# EAGLE design theremin_PCB (EAGLE 7.1.0)
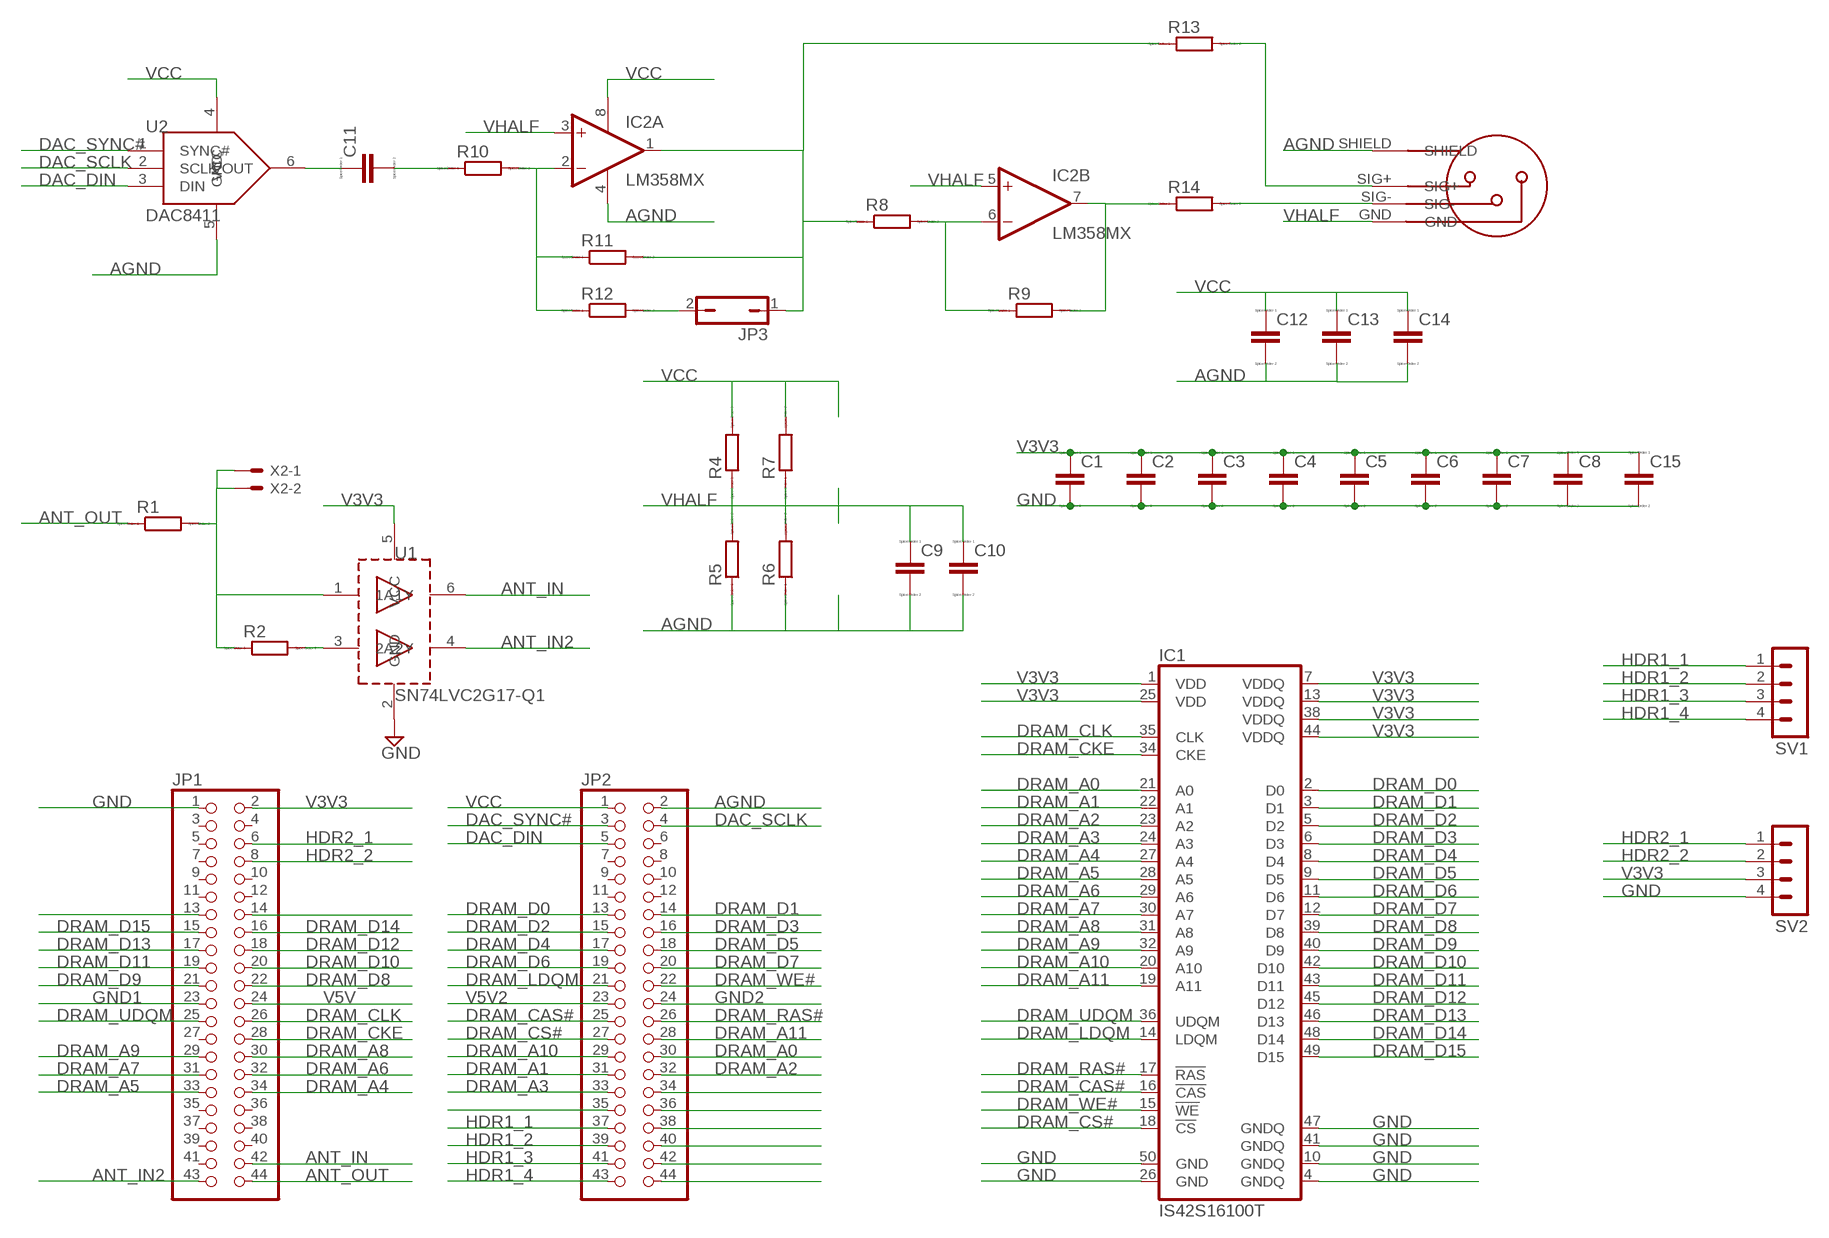
[diagram p0: schematic, sheet 1]

## Parts
C1  C-EUC0805  [C0805]
C2  C-EUC0805  [C0805]
C3  C-EUC0805  [C0805]
C4  C-EUC0805  [C0805]
C5  C-EUC0805  [C0805]
C6  C-EUC0805  [C0805]
C7  C-EUC0805  [C0805]
C8  C-EUC0805  [C0805]
C9  C-EUC0805  [C0805]
C10  C-EUC0805  [C0805]
C11  C-EUC0805  [C0805]
C12  C-EUC0805  [C0805]
C13  C-EUC0805  [C0805]
C14  C-EUC0805  [C0805]
C15  C-EUC0805  [C0805]
IC1  IS42S16100T  [TSOP50-II]
IC2  LM358MX  [SO08]
JP1  PINHD-2X22  [2X22]
JP2  PINHD-2X22  [2X22]
JP3  JP1Q  [JP1]
R1  R-EU_R0603  [R0603]
R2  R-EU_R0603  [R0603]
R4  R-EU_M0805  [M0805]
R5  R-EU_M0805  [M0805]
R6  R-EU_M0805  [M0805]
R7  R-EU_M0805  [M0805]
R8  R-EU_M0805  [M0805]
R9  R-EU_M0805  [M0805]
R10  R-EU_M0805  [M0805]
R11  R-EU_M0805  [M0805]
R12  R-EU_M0805  [M0805]
R13  R-EU_M0805  [M0805]
R14  R-EU_M0805  [M0805]
SV1  MA04-1  [MA04-1]
SV2  MA04-1  [MA04-1]
U1  SN74LVC2G17-Q1  [DCK_R-PDSO-G6]
U2  DAC8411  [DCK_R-PDSO-G6]
U$1  MINIXLR  [MINXLR]
X2  KK-156-2  [KK-156-2]

## Nets
AGND: C9.2 C10.2 C12.2 C13.2 C14.2 IC2.4(P:V-) JP2.2 R5.1 R6.1 U2.5(GND) U$1.SHIELD
ANT_IN: JP1.42 U1.6(1Y)
ANT_IN2: JP1.43 U1.4(2Y)
ANT_OUT: JP1.44 R1.1
DAC_DIN: JP2.5 U2.3(DIN)
DAC_SCLK: JP2.4 U2.2(SCLK)
DAC_SYNC#: JP2.3 U2.1(SYNC#)
DRAM_A0: IC1.21(A0) JP2.30
DRAM_A1: IC1.22(A1) JP2.31
DRAM_A2: IC1.23(A2) JP2.32
DRAM_A3: IC1.24(A3) JP2.33
DRAM_A4: IC1.27(A4) JP1.34
DRAM_A5: IC1.28(A5) JP1.33
DRAM_A6: IC1.29(A6) JP1.32
DRAM_A7: IC1.30(A7) JP1.31
DRAM_A8: IC1.31(A8) JP1.30
DRAM_A9: IC1.32(A9) JP1.29
DRAM_A10: IC1.20(A10) JP2.29
DRAM_A11: IC1.19(A11) JP2.28
DRAM_CAS#: IC1.16(!CAS) JP2.25
DRAM_CKE: IC1.34(CKE) JP1.28
DRAM_CLK: IC1.35(CLK) JP1.26
DRAM_CS#: IC1.18(!CS) JP2.27
DRAM_D0: IC1.2(D0) JP2.13
DRAM_D1: IC1.3(D1) JP2.14
DRAM_D2: IC1.5(D2) JP2.15
DRAM_D3: IC1.6(D3) JP2.16
DRAM_D4: IC1.8(D4) JP2.17
DRAM_D5: IC1.9(D5) JP2.18
DRAM_D6: IC1.11(D6) JP2.19
DRAM_D7: IC1.12(D7) JP2.20
DRAM_D8: IC1.39(D8) JP1.22
DRAM_D9: IC1.40(D9) JP1.21
DRAM_D10: IC1.42(D10) JP1.20
DRAM_D11: IC1.43(D11) JP1.19
DRAM_D12: IC1.45(D12) JP1.18
DRAM_D13: IC1.46(D13) JP1.17
DRAM_D14: IC1.48(D14) JP1.16
DRAM_D15: IC1.49(D15) JP1.15
DRAM_LDQM: IC1.14(LDQM) JP2.21
DRAM_RAS#: IC1.17(!RAS) JP2.26
DRAM_UDQM: IC1.36(UDQM) JP1.25
DRAM_WE#: IC1.15(!WE) JP2.22
GND: C1.2 C2.2 C3.2 C4.2 C5.2 C6.2 C7.2 C8.2 C15.2 IC1.4(GNDQ) IC1.10(GNDQ) IC1.26(GND) IC1.41(GNDQ) IC1.47(GNDQ) IC1.50(GND) JP1.1 SV2.4 U1.2(GND)
GND1: JP1.23
GND2: JP2.24
HDR1_1: JP2.37 SV1.1
HDR1_2: JP2.39 SV1.2
HDR1_3: JP2.41 SV1.3
HDR1_4: JP2.43 SV1.4
HDR2_1: JP1.6 SV2.1
HDR2_2: JP1.8 SV2.2
N$1: R1.2 R2.1 U1.1(1A) X2.1 X2.2
N$2: C11.1 U2.6(VOUT)
N$3: C11.2 R10.1
N$4: R2.2 U1.3(2A)
N$6: IC2.2(A:-IN) R10.2 R11.1 R12.1
N$7: JP3.2 R12.2
N$8: IC2.1(A:OUT) JP3.1 R8.1 R11.2 R13.1
N$9: R14.2 U$1.SIG-
N$10: IC2.6(B:-IN) R8.2 R9.1
N$11: IC2.7(B:OUT) R9.2 R14.1
N$12: R13.2 U$1.SIG+
N$14: JP2.34
N$15: JP2.35
N$16: JP2.36
N$19: JP2.38
N$20: JP2.40
N$22: JP2.42
N$24: JP2.44
N$25: JP1.14
N$35: JP1.13
V3V3: C1.1 C2.1 C3.1 C4.1 C5.1 C6.1 C7.1 C8.1 C15.1 IC1.1(VDD) IC1.7(VDDQ) IC1.13(VDDQ) IC1.25(VDD) IC1.38(VDDQ) IC1.44(VDDQ) JP1.2 SV2.3 U1.5(VCC)
V5V: JP1.24
V5V2: JP2.23
VCC: C12.1 C13.1 C14.1 IC2.8(P:V+) JP2.1 R4.2 R7.2 U2.4(VCC)
VHALF: C9.1 C10.1 IC2.3(A:+IN) IC2.5(B:+IN) R4.1 R5.2 R6.2 R7.1 U$1.GND
Unconnected: JP1.3 JP1.4 JP1.5 JP1.7 JP1.9 JP1.10 JP1.11 JP1.12 JP1.27 JP1.35 JP1.36 JP1.37 JP1.38 JP1.39 JP1.40 JP1.41 JP2.6 JP2.7 JP2.8 JP2.9 JP2.10 JP2.11 JP2.12

## Library data of the parts
C1-C15 = resistor:C-EU: CAPACITOR, European symbol; SPICEPREFIX: C
IC1 = memory:IS42S16100T: 512K Words x 16 Bits x 2 Banks (16-MBIT) SYNCHRONOUS DYNAMIC RAM Source: www.issi.com .. IS42S16100.pdf
IC2 = linear:LM358: OP AMP also LM158; LM258; LM2904 Source: http://cache.national.com/ds/LM/LM158.pdf
JP1 JP2 = pinhead:PINHD-2X22: PIN HEADER
JP3 = jumper:JP1Q: JUMPER
R1 R2 R4-R14 = resistor:R-EU_: RESISTOR, European symbol; SPICEPREFIX: R
SV1 SV2 = con-lstb:MA04-1: PIN HEADER; OC_FARNELL: unknown; OC_NEWARK: unknown
U1 = jan:SN74LVC2G17-Q1
U2 = jan:DAC8411: 2.0V to 5.5V, 80μA, 14- and 16-Bit, Low-Power, Single-Channel, Digital-to-Analog Converters in SC70 Package
U$1 = jan:MINIXLR
X2 = con-molex:KK-156-2: KK 156 HEADER Source: http://www.molex.com/pdm_docs/sd/026604100_sd.pdf; OC_FARNELL: unknown; OC_NEWARK: unknown

## Board
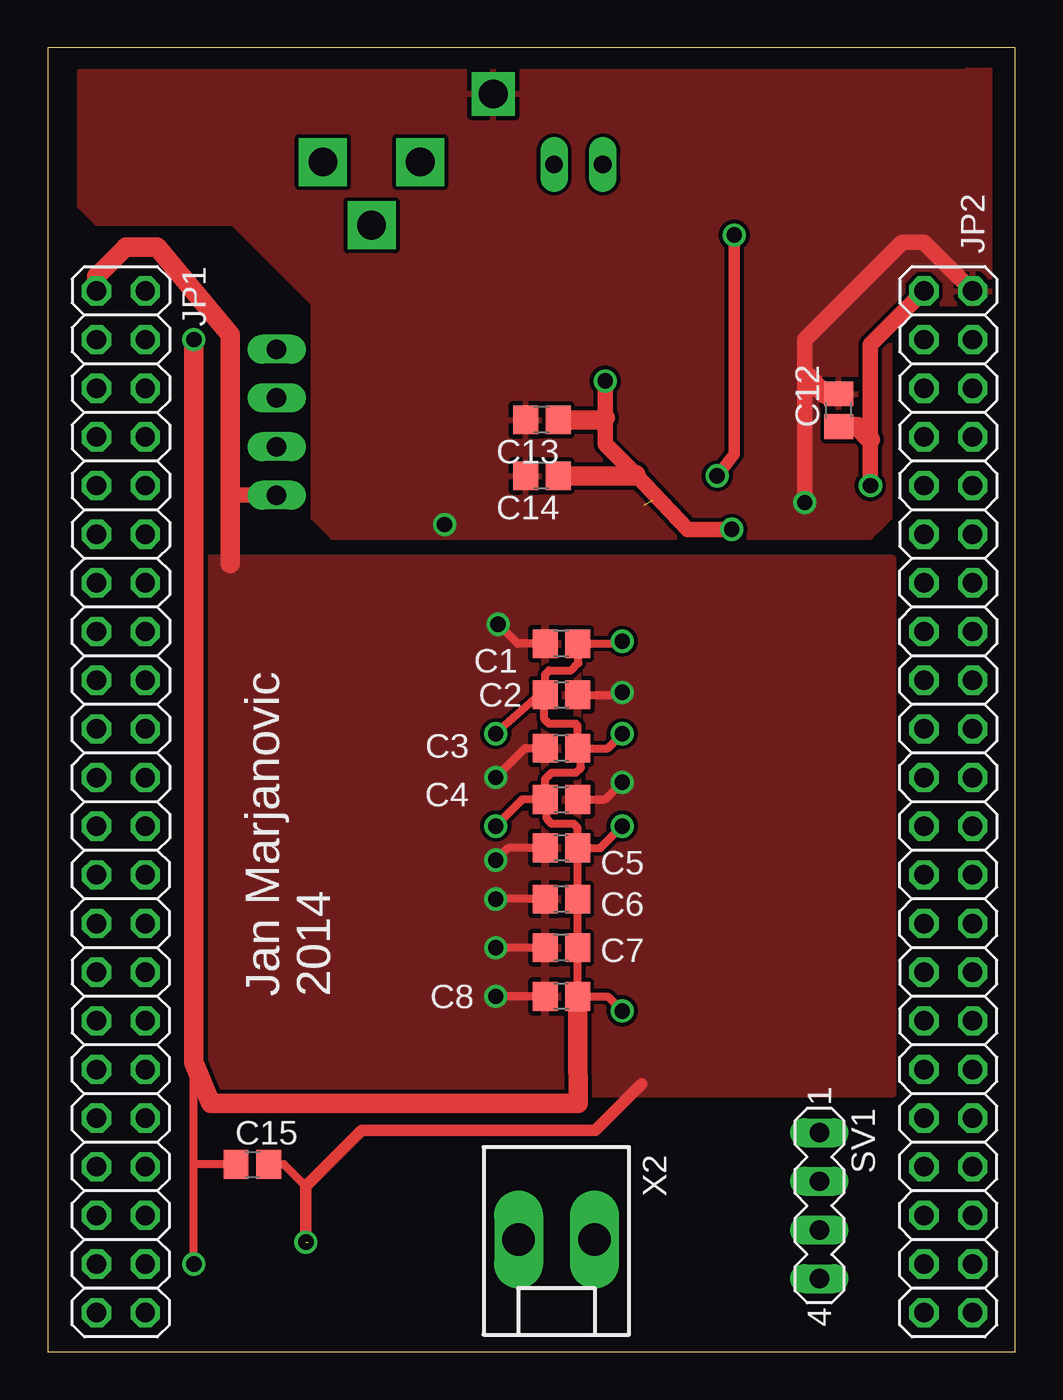
[diagram p1: board, top side]
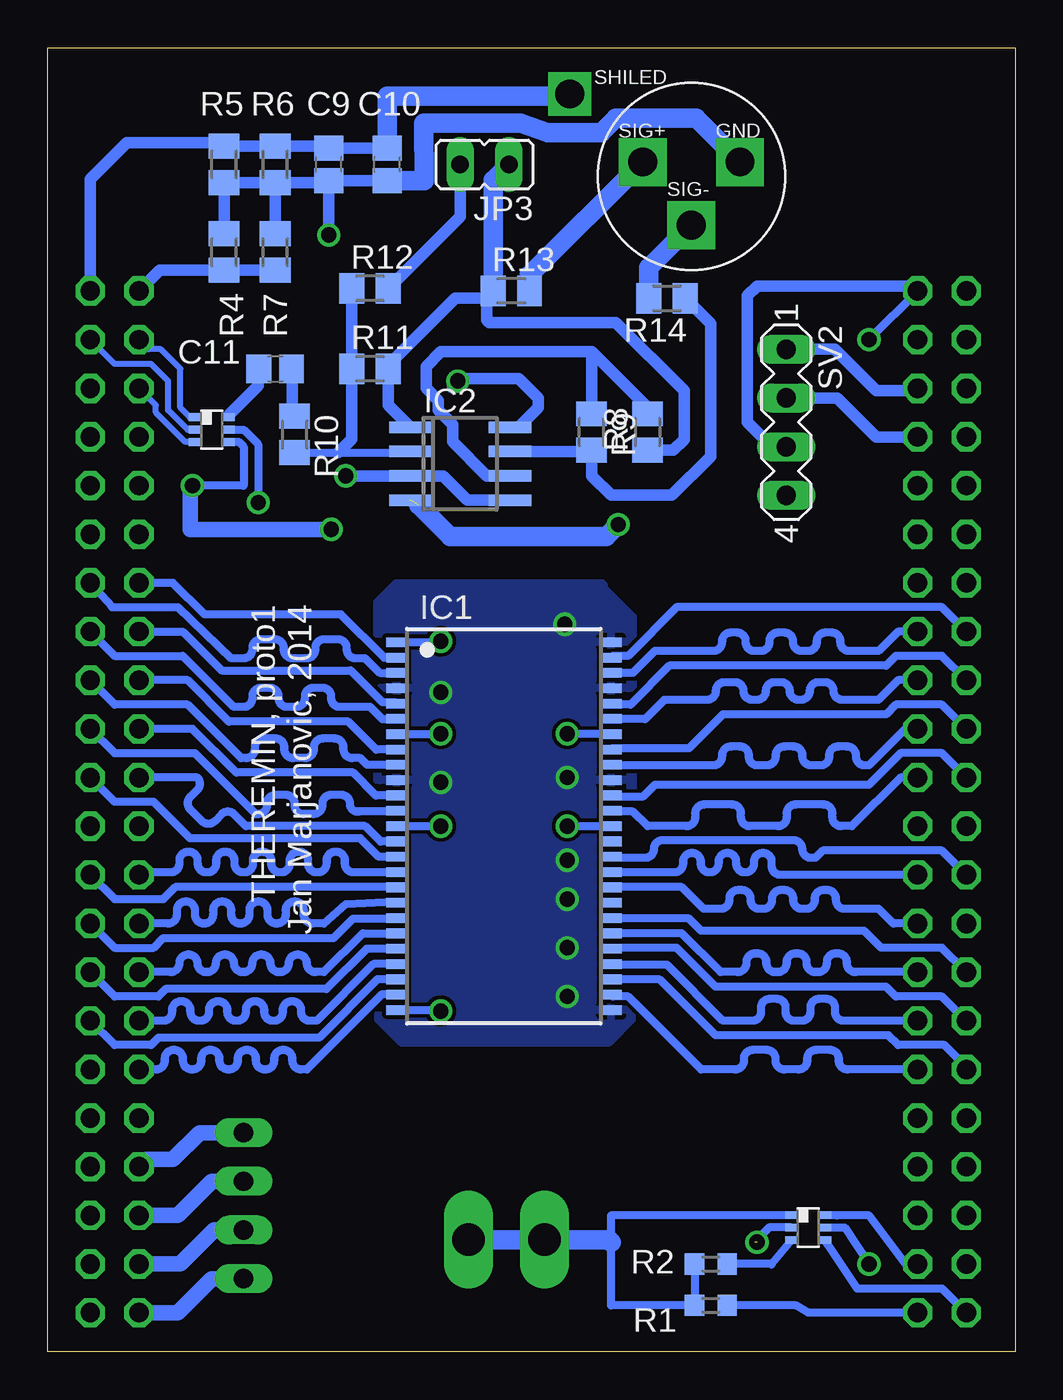
[diagram p2: board, bottom side, seen from below]

Size 50.47 x 68.06 mm. Coordinates in mm from the lower left corner, seen from the top.
Outline: 0,0 50.47,0 50.47,68.06 0,68.06 0,0
Copper layers (1*16): Top 0.035mm / dielectric 1.5mm / Bottom 0.035mm
Design rules "default": minimum track width 10mil, minimum drill 24mil, track to track 8mil, track to pad 8mil, pad to pad 8mil, via to via 8mil, smd to smd 8mil, copper to edge 40mil, drill to drill 8mil, minimum pad ring 10mil, minimum via ring 8mil, stop-mask expansion 4mil, vias tented up to drill 0mil, thermal gap 10mil

### Footprints (pad centres in the part's own frame; a part is rotated, then mirrored left to right if it is on the bottom)
C0805 = smd 1.3 x 1.5: 1 -0.85,0; 2 0.85,0
TSOP50-II = smd 0.5 x 1.1: 1 -9.6,-5.6; 2 -8.8,-5.6; 3 -8,-5.6; 4 -7.2,-5.6; 5 -6.4,-5.6; 6 -5.6,-5.6; 7 -4.8,-5.6; 8 -4,-5.6; 9 -3.2,-5.6; 10 -2.4,-5.6; 11 -1.6,-5.6; 12 -0.8,-5.6; 13 0,-5.6; 14 0.8,-5.6; 15 1.6,-5.6; 16 2.4,-5.6; 17 3.2,-5.6; 18 4,-5.6; 19 4.8,-5.6; 20 5.6,-5.6; 21 6.4,-5.6; 22 7.2,-5.6; 23 8,-5.6; 24 8.8,-5.6; 25 9.6,-5.6; 26 9.6,5.6; 27 8.8,5.6; 28 8,5.6; 29 7.2,5.6; 30 6.4,5.6; 31 5.6,5.6; 32 4.8,5.6; 33 4,5.6; 34 3.2,5.6; 35 2.4,5.6; 36 1.6,5.6; 37 0.8,5.6; 38 0,5.6; 39 -0.8,5.6; 40 -1.6,5.6; 41 -2.4,5.6; 42 -3.2,5.6; 43 -4,5.6; 44 -4.8,5.6; 45 -5.6,5.6; 46 -6.4,5.6; 47 -7.2,5.6; 48 -8,5.6; 49 -8.8,5.6; 50 -9.6,5.6
SO08 = smd 0.6 x 2.2: 1 -1.905,-2.6; 2 -0.635,-2.6; 3 0.635,-2.6; 4 1.905,-2.6; 5 1.905,2.6; 6 0.635,2.6; 7 -0.635,2.6; 8 -1.905,2.6
2X22 = drill 1.016 octagon: 1 -25.4,-1.27; 2 -25.4,1.27; 3 -22.86,-1.27; 4 -22.86,1.27; 5 -20.32,-1.27; 6 -20.32,1.27; 7 -17.78,-1.27; 8 -17.78,1.27; 9 -15.24,-1.27; 10 -15.24,1.27; 11 -12.7,-1.27; 12 -12.7,1.27; 13 -10.16,-1.27; 14 -10.16,1.27; 15 -7.62,-1.27; 16 -7.62,1.27; 17 -5.08,-1.27; 18 -5.08,1.27; 19 -2.54,-1.27; 20 -2.54,1.27; 21 0,-1.27; 22 0,1.27; 23 2.54,-1.27; 24 2.54,1.27; 25 5.08,-1.27; 26 5.08,1.27; 27 7.62,-1.27; 28 7.62,1.27; 29 10.16,-1.27; 30 10.16,1.27; 31 12.7,-1.27; 32 12.7,1.27; 33 15.24,-1.27; 34 15.24,1.27; 35 17.78,-1.27; 36 17.78,1.27; 37 20.32,-1.27; 38 20.32,1.27; 39 22.86,-1.27; 40 22.86,1.27; 41 25.4,-1.27; 42 25.4,1.27; 43 27.94,-1.27; 44 27.94,1.27
JP1 = drill 0.914 long: 1 0,-1.27; 2 0,1.27
R0603 = smd 1 x 1.1: 1 -0.85,0; 2 0.85,0
M0805 = smd 1.3 x 1.6: 1 -0.95,0; 2 0.95,0
MA04-1 = drill 1.016 long: 1 -3.81,0; 2 -1.27,0; 3 1.27,0; 4 3.81,0
DCK_R-PDSO-G6 = smd 0.4 x 0.7: 1 -0.65,-0.85; 2 0,-0.85; 3 0.65,-0.85; 4 0.65,0.85; 5 0,0.85; 6 -0.65,0.85
MINXLR = drill 1.5 pad 2.5 square: GND 8.89,2.54; SIG+ 3.81,2.54; SIG- 6.35,-0.762 | drill 1.5 pad 2 square: SHIELD 0,6.096
KK-156-2 = drill 1.7 pad 2.184 long: 1 -1.98,0; 2 1.98,0

### Placement (x,y rotation side)
C1  26.8,36.96 180 top
C2  26.8,34.29 0 top
C3  26.8,31.5 180 top
C4  26.8,28.83 0 top
C5  26.8,26.29 180 top
C6  26.8,23.62 180 top
C7  26.8,21.08 180 top
C8  26.8,18.54 180 top
C9  35.81,61.98 90 bottom
C10  32.77,61.98 90 bottom
C11  38.61,51.31 0 bottom
C12  41.28,49.15 90 top
C13  25.78,48.64 180 top
C14  25.78,45.72 180 top
C15  10.67,9.78 0 top
IC1  26.67,27.43 270 bottom
IC2  28.96,46.36 270 bottom
JP1  3.81,29.97 270 top
JP2  46.99,29.97 270 top
JP3  27.69,61.98 90 bottom
R1  15.88,2.41 180 bottom
R2  15.88,4.57 0 bottom
R4  41.28,57.4 270 bottom
R5  41.28,61.98 270 bottom
R6  38.61,61.98 270 bottom
R7  38.61,57.4 270 bottom
R8  19.18,48.01 90 bottom
R9  22.1,48.01 270 bottom
R10  37.59,47.88 270 bottom
R11  33.66,51.31 0 bottom
R12  33.66,55.5 0 bottom
R13  26.29,55.37 0 bottom
R14  18.16,54.99 180 bottom
SV1  40.26,7.62 270 top
SV2  11.94,48.51 270 bottom
U1  10.79,6.48 270 bottom
U2  41.91,48.13 270 bottom
U$1  23.24,59.56 0 bottom
X2  26.54,5.84 180 top

### Tracks (layer width: path | path; a pad name or v marks a point on that pad's centre or on a via)
AGND  (via drill 0.8)  (1 unrouted)
  Top 0.813: v39.5,44.32 39.5,51.05 39.5,52.83 44.58,57.91 45.72,57.91 JP2.2
  Top 1.016: C12.2 40.55,50 39.5,51.05
  Bottom 0.406: v39.5,44.32 39.5,47.37 40.26,48.13 U2.5 | v39.5,44.32 39.5,43.94 | 39.37,44.45 v39.5,44.32
  Bottom 0.61: JP2.2 48.26,61.21 46.36,63.12 41.47,63.12 R5.1 R6.1 35.91,62.93 C9.2 C10.2
  Bottom 1.016: C10.2 32.77,65.53 23.37,65.53 U$1.SHIELD | 31.11,44.2 29.46,42.55 21.34,42.55 v20.7,43.18
  pour Top: 1.65,66.8 1.65,59.82 2.54,58.93 9.65,58.93 13.84,54.74 13.84,43.56 14.86,42.55 42.93,42.55 43.31,42.93 43.94,43.56 43.94,53.98 44.7,54.74 48.9,54.74 49.15,54.99 49.15,66.93 48.01,66.93 48.01,66.8
ANT_IN
  Bottom 0.406: JP1.42 5.71,4.57 7.62,7.11 9.29,7.11 U1.6
ANT_IN2
  Bottom 0.406: U1.4 9.51,5.19 8.26,3.3 3.81,3.3 JP1.43
ANT_OUT
  Bottom 0.406: JP1.44 10.79,2.03 11.43,2.41 R1.1
DAC_DIN
  Bottom 0.305: U2.3 43.29,47.48 44.83,49.02 44.83,49.4 JP2.5
DAC_SCLK
  Bottom 0.305: U2.2 43.18,48.13 44.2,49.15 44.2,50.67 45.09,51.56 46.99,51.56 JP2.4
DAC_SYNC#
  Bottom 0.305: U2.1 43.07,48.78 43.56,49.28 43.56,51.31 44.58,52.32 45.21,52.32 JP2.3
DRAM_A0
  Bottom 0.406: IC1.21 33.83,21.03 35.94,18.92 44.32,18.92 44.7,18.54 46.99,18.54 JP2.30
DRAM_A1
  Bottom 0.406: JP2.31 44.45,17.27 arc-90 43.99,17.73 43.99,17.83 arc90 43.54,18.29 43.49,18.29 arc90 43.03,17.83 43.03,17.73 arc-90 42.57,17.27 42.53,17.27 arc-90 42.07,17.73 42.07,17.83 arc90 41.61,18.29 41.56,18.29 arc90 41.11,17.83 41.11,17.73 arc-90 40.65,17.27 40.6,17.27 arc-90 40.14,17.73 40.14,17.83 arc90 39.69,18.29 39.64,18.29 arc90 39.18,17.83 39.18,17.73 arc-90 38.72,17.27 38.67,17.27 arc-90 38.22,17.73 38.22,17.83 arc90 37.76,18.29 37.71,18.29 arc90 37.25,17.83 37.25,17.73 arc-90 36.8,17.27 36.45,17.27 33.49,20.23 IC1.22
DRAM_A2
  Bottom 0.406: IC1.23 33.27,19.43 36.32,16.38 44.7,16.38 45.09,16 46.99,16 JP2.32
DRAM_A3
  Bottom 0.406: JP2.33 44.83,14.73 arc-90 44.37,15.19 44.37,15.29 arc90 43.92,15.75 43.88,15.75 arc90 43.42,15.29 43.42,15.19 arc-90 42.97,14.73 42.93,14.73 arc-90 42.47,15.19 42.47,15.29 arc90 42.01,15.75 41.98,15.75 arc90 41.52,15.29 41.52,15.19 arc-90 41.06,14.73 41.02,14.73 arc-90 40.57,15.19 40.57,15.29 arc90 40.11,15.75 40.07,15.75 arc90 39.62,15.29 39.62,15.19 arc-90 39.16,14.73 39.12,14.73 arc-90 38.66,15.19 38.66,15.29 arc90 38.21,15.75 38.17,15.75 arc90 37.71,15.29 37.71,15.19 arc-90 37.25,14.73 36.96,14.73 33.02,18.67 32.31,18.67 IC1.24
DRAM_A4
  Bottom 0.406: JP1.34 8.74,14.73 arc90 9.19,15.19 9.19,15.29 arc-90 9.65,15.75 10.39,15.75 arc-90 10.84,15.29 10.84,15.19 arc90 11.3,14.73 12.04,14.73 arc90 12.5,15.19 12.5,15.29 arc-90 12.95,15.75 13.69,15.75 arc-90 14.15,15.29 14.15,15.19 arc90 14.61,14.73 16.38,14.73 20.19,18.54 20.98,18.54 IC1.27
DRAM_A5
  Bottom 0.406: JP1.33 2.54,14.86 3.68,16 6.1,16 6.6,16.51 15.62,16.51 18.54,19.43 IC1.28
DRAM_A6
  Bottom 0.406: JP1.32 8.93,17.27 arc90 9.39,17.73 9.39,17.96 arc-90 9.85,18.41 10.22,18.41 arc-90 10.68,17.96 10.68,17.73 arc90 11.14,17.27 11.51,17.27 arc90 11.97,17.73 11.97,17.96 arc-90 12.43,18.41 12.8,18.41 arc-90 13.26,17.96 13.26,17.73 arc90 13.72,17.27 15.24,17.27 18.16,20.19 21.03,20.19 IC1.29
DRAM_A7
  Bottom 0.406: JP1.31 3.81,18.54 6.22,18.54 6.73,19.05 15.62,19.05 17.65,21.08 21.02,21.08 IC1.30
DRAM_A8
  Bottom 0.406: JP1.30 8.32,19.81 arc90 8.78,20.27 8.78,20.33 arc-90 9.23,20.79 9.37,20.79 arc-90 9.82,20.33 9.82,20.27 arc90 10.28,19.81 10.42,19.81 arc90 10.87,20.27 10.87,20.33 arc-90 11.33,20.79 11.46,20.79 arc-90 11.92,20.33 11.92,20.27 arc90 12.38,19.81 12.51,19.81 arc90 12.97,20.27 12.97,20.33 arc-90 13.43,20.79 13.56,20.79 arc-90 14.02,20.33 14.02,20.27 arc90 14.48,19.81 15.37,19.81 17.4,21.84 21.06,21.84 IC1.31
DRAM_A9
  Bottom 0.406: JP1.29 3.81,21.08 6.98,21.08 7.87,21.97 16.38,21.97 17.02,22.61 20.84,22.61 IC1.32
DRAM_A10
  Bottom 0.406: JP2.29 44.07,19.81 arc-90 43.61,20.27 arc90 43.16,20.73 43.12,20.73 arc90 42.66,20.27 arc-90 42.2,19.81 42.17,19.81 arc-90 41.71,20.27 arc90 41.25,20.73 41.22,20.73 arc90 40.76,20.27 arc-90 40.3,19.81 40.27,19.81 arc-90 39.81,20.27 arc90 39.35,20.73 39.31,20.73 arc90 38.86,20.27 arc-90 38.4,19.81 38.36,19.81 arc-90 37.91,20.27 arc90 37.45,20.73 37.41,20.73 arc90 36.96,20.27 arc-90 36.5,19.81 36.07,19.81 34.04,21.84 32.28,21.84 IC1.20
DRAM_A11
  Bottom 0.406: JP2.28 46.99,21.08 44.96,21.08 44.45,21.59 35.56,21.59 34.54,22.61 32.3,22.61 IC1.19
DRAM_CAS#
  Bottom 0.406: IC1.16 32.28,25.02 34.51,25.02 arc90 34.97,25.48 34.97,25.64 arc-90 35.43,26.09 35.47,26.09 arc-90 35.93,25.64 35.93,25.48 arc90 36.39,25.02 36.43,25.02 arc90 36.89,25.48 36.89,25.64 arc-90 37.35,26.09 37.39,26.09 arc-90 37.85,25.64 37.85,25.48 arc90 38.31,25.02 38.35,25.02 arc90 38.81,25.48 38.81,25.64 arc-90 39.27,26.09 39.31,26.09 arc-90 39.77,25.64 39.77,25.48 arc90 40.23,25.02 40.27,25.02 arc90 40.73,25.48 40.73,25.64 arc-90 41.19,26.09 41.23,26.09 arc-90 41.69,25.64 41.69,25.48 arc90 42.15,25.02 42.19,25.02 arc90 42.65,25.48 42.65,25.64 arc-90 43.11,26.09 43.16,26.09 arc-90 43.61,25.64 43.61,25.48 arc90 44.07,25.02 45.59,25.02 JP2.25
DRAM_CKE
  Bottom 0.406: JP1.28 6.35,22.35 7.11,23.11 8.88,23.11 arc90 9.34,23.57 9.34,23.64 arc-90 9.8,24.09 10,24.09 arc-90 10.46,23.64 10.46,23.57 arc90 10.91,23.11 11.11,23.11 arc90 11.57,23.57 11.57,23.64 arc-90 12.03,24.09 12.23,24.09 arc-90 12.68,23.64 12.68,23.57 arc90 13.14,23.11 13.34,23.11 arc90 13.8,23.57 13.8,23.64 arc-90 14.25,24.09 14.45,24.09 arc-90 14.91,23.64 14.91,23.57 arc90 15.37,23.11 16.26,23.11 17.4,24.26 21.04,24.26 IC1.34
DRAM_CLK
  Bottom 0.406: JP1.26 12.24,24.89 arc90 12.7,25.35 12.7,25.58 arc-90 13.15,26.04 13.17,26.04 arc-90 13.62,25.58 13.62,25.48 arc90 14.08,25.02 14.09,25.02 arc90 14.55,25.48 14.55,25.58 arc-90 15,26.04 15.02,26.04 arc-90 15.47,25.58 15.47,25.48 arc90 15.93,25.02 15.94,25.02 arc90 16.4,25.48 16.4,25.58 arc-90 16.86,26.04 16.87,26.04 arc-90 17.32,25.58 17.32,25.48 arc90 17.78,25.02 21.06,25.02 IC1.35
DRAM_CS#
  Bottom 0.406: JP2.27 44.2,22.35 arc-90 43.74,22.81 43.74,23.04 arc90 43.28,23.5 43.25,23.5 arc90 42.79,23.04 42.79,22.81 arc-90 42.34,22.35 42.3,22.35 arc-90 41.85,22.81 41.85,23.04 arc90 41.39,23.5 41.36,23.5 arc90 40.9,23.04 40.9,22.81 arc-90 40.44,22.35 40.41,22.35 arc-90 39.96,22.81 39.96,23.04 arc90 39.5,23.5 39.47,23.5 arc90 39.01,23.04 39.01,22.81 arc-90 38.55,22.35 38.52,22.35 arc-90 38.06,22.81 38.06,23.04 arc90 37.61,23.5 37.57,23.5 arc90 37.12,23.04 37.12,22.81 arc-90 36.66,22.35 36.07,22.35 34.93,23.37 32.33,23.5 IC1.18
DRAM_D0
  Bottom 0.406: IC1.2 32.93,36.23 35.18,38.48 42.29,38.48 43.94,40.13 JP2.13
DRAM_D1
  Bottom 0.406: JP2.14 47.12,38.86 43.69,38.86 40.89,36.2 40.26,36.2 arc-90 39.8,36.65 39.8,36.73 arc90 39.35,37.18 38.62,37.18 arc90 38.16,36.73 38.16,36.65 arc-90 37.7,36.2 36.97,36.2 arc-90 36.52,36.65 36.52,36.73 arc90 36.06,37.18 35.33,37.18 arc90 34.87,36.73 34.87,36.65 arc-90 34.42,36.2 33.91,36.2 33.15,35.43 IC1.3
DRAM_D2
  Bottom 0.406: JP2.15 43.43,37.59 41.4,35.56 34.67,35.56 33.02,33.91 32.35,33.91 IC1.5
DRAM_D3
  Bottom 0.406: JP2.16 46.99,36.32 43.43,36.32 40.77,33.66 40.26,33.66 arc-90 39.8,34.11 39.8,34.2 arc90 39.35,34.66 38.89,34.66 arc90 38.43,34.2 38.43,34.11 arc-90 37.97,33.66 37.52,33.66 arc-90 37.06,34.11 37.06,34.2 arc90 36.6,34.66 36.15,34.66 arc90 35.69,34.2 35.69,34.11 arc-90 35.23,33.66 33.66,33.66 33.02,33.02 32.28,33.02 IC1.6
DRAM_D4
  Bottom 0.406: IC1.8 33.34,31.43 34.8,32.89 41.02,32.89 43.18,35.05 JP2.17
DRAM_D5
  Bottom 0.406: IC1.9 33.81,30.63 34.16,30.99 34.59,30.99 arc90 35.05,31.45 35.05,31.55 arc-90 35.5,32 36.13,32 arc-90 36.59,31.55 36.59,31.45 arc90 37.05,30.99 37.68,30.99 arc90 38.13,31.45 38.13,31.55 arc-90 38.59,32 39.22,32 arc-90 39.68,31.55 39.68,31.45 arc90 40.13,30.99 40.39,30.99 43.18,33.78 46.99,33.78 JP2.18
DRAM_D6
  Bottom 0.406: IC1.11 33.35,29.03 34.54,30.23 40.64,30.23 42.93,32.51 JP2.19
DRAM_D7
  Bottom 0.406: JP2.20 46.99,31.24 42.8,31.24 39.62,28.07 39.5,28.07 arc-90 39.04,28.52 39.04,28.61 arc90 38.58,29.07 38.05,29.07 arc90 37.59,28.61 37.59,28.52 arc-90 37.14,28.07 36.61,28.07 arc-90 36.15,28.52 36.15,28.61 arc90 35.69,29.07 35.16,29.07 arc90 34.7,28.61 34.7,28.52 arc-90 34.24,28.19 32.44,28.19 IC1.12
DRAM_D8
  Bottom 0.406: JP1.22 5.97,29.97 8.51,27.43 9.07,27.43 arc90 9.53,27.89 9.53,28.1 arc-90 9.99,28.56 11.46,28.56 arc-90 11.92,28.1 11.92,27.89 arc90 12.37,27.43 13.84,27.43 arc90 14.3,27.89 14.3,28.1 arc-90 14.76,28.56 16.23,28.56 arc-90 16.69,28.1 16.69,27.89 arc90 17.14,27.43 19.18,27.43 19.94,28.19 21.03,28.19 IC1.39
DRAM_D9
  Bottom 0.406: JP1.21 3.81,31.24 5.97,31.24 7.62,29.59 18.8,29.59 19.43,28.96 20.99,28.96 IC1.40
DRAM_D10
  Bottom 0.406: JP1.20 5.71,32.51 7.62,30.61 7.84,30.61 arc90 8.3,31.06 8.3,31.13 arc-90 8.76,31.59 9.24,31.59 arc-90 9.7,31.13 9.7,31.06 arc90 10.15,30.61 10.64,30.61 arc90 11.09,31.06 11.09,31.13 arc-90 11.55,31.59 12.04,31.59 arc-90 12.49,31.13 12.49,31.06 arc90 12.95,30.61 13.43,30.61 arc90 13.89,31.06 13.89,31.13 arc-90 14.35,31.59 14.83,31.59 arc-90 15.29,31.13 15.29,31.06 arc90 15.75,30.61 21.04,30.61 IC1.42
DRAM_D11
  Bottom 0.406: JP1.19 3.81,33.78 6.22,33.78 6.73,33.27 15.24,33.27 17.02,31.5 21.01,31.5 IC1.43
DRAM_D12
  Bottom 0.406: JP1.18 6.1,35.05 7.11,34.04 9.02,34.04 arc90 9.47,34.49 arc-90 9.93,34.95 10.25,34.95 arc-90 10.71,34.49 arc90 11.16,34.04 11.3,34.04 arc90 11.76,34.49 arc-90 12.22,34.95 12.54,34.95 arc-90 13,34.49 arc90 13.46,34.04 13.72,34.04 arc90 14.17,34.49 arc-90 14.63,34.95 15.15,34.95 arc-90 15.61,34.49 arc90 16.07,34.04 18.29,34.04 19.3,33.02 21.06,33.02 IC1.45
DRAM_D13
  Bottom 0.406: JP1.17 3.81,36.32 6.22,36.32 6.73,35.81 18.03,35.81 20.07,33.78 21.02,33.78 IC1.46
DRAM_D14
  Bottom 0.406: IC1.48 19.94,35.43 18.8,36.58 15.75,36.58 arc-90 15.29,37.03 15.29,37.08 arc90 14.83,37.54 14.51,37.54 arc90 14.05,37.08 14.05,37.03 arc-90 13.6,36.58 13.28,36.58 arc-90 12.82,37.03 12.82,37.08 arc90 12.36,37.54 12.04,37.54 arc90 11.58,37.08 11.58,37.03 arc-90 11.13,36.58 10.8,36.58 arc-90 10.35,37.03 10.35,37.08 arc90 9.89,37.54 9.57,37.54 arc90 9.11,37.08 9.11,37.03 arc-90 8.65,36.58 7.11,36.58 6.1,37.59 JP1.16
DRAM_D15
  Bottom 0.406: JP1.15 3.81,38.86 17.65,38.86 20.19,36.32 20.98,36.32 IC1.49
DRAM_LDQM
  Bottom 0.406: IC1.14 33.11,26.63 33.91,27.43 40.13,27.43 40.76,28.06 arc-90 41.41,28.06 41.78,27.69 arc90 42.42,27.69 43.04,28.31 arc90 43.04,28.96 42.67,29.32 arc-90 42.67,29.97 JP2.21
DRAM_RAS#
  Bottom 0.406: JP2.26 46.99,23.62 44.45,23.62 43.82,24.26 32.3,24.26 IC1.17
DRAM_UDQM
  Bottom 0.406: JP1.25 3.81,26.16 10.03,26.16 10.41,25.78 10.64,25.78 arc90 11.1,26.24 arc-90 11.56,26.7 18.39,26.7 arc-90 18.85,26.24 arc90 19.3,25.78 21.02,25.78 IC1.36
DRAM_WE#
  Bottom 0.406: IC1.15 33.2,25.83 34.16,26.8 43.05,26.8 44.96,28.7 46.99,28.7 JP2.22
GND  (via drill 0.8)  (1 unrouted)
  Top 0.406: C8.2 v23.37,18.54 | C7.2 v23.37,21.08 | C6.2 v23.37,23.62 | C5.2 24,26.29 v23.37,25.65 | C3.2 24.89,31.5 v23.37,29.97 | C4.2 29.08,28.83 v29.97,29.72 | C2.2 29.84,34.29 v29.97,34.42 | C1.2 24.51,36.96 v23.5,37.97 | C15.2 12.32,9.78 13.46,8.64
  Top 0.61: v13.46,5.71 13.46,8.64 16.38,11.56 28.57,11.56 30.99,13.97
  Top 0.813: SV2.4 9.65,44.7 9.53,44.83
  Top 1.016: JP1.1 2.54,56.13 4.06,57.66 5.71,57.66 9.53,53.09 9.53,44.83 9.53,41.15
  Bottom 0.406: U1.2 12.83,6.48 13.59,5.71
  pour Bottom: 21.59,40.01 19.94,38.35 19.94,17.4 21.21,16.13 22.1,16.13 32,16.13 33.27,17.4 33.27,17.91 33.27,39.12 32.26,40.13 21.59,40.13 21.46,40.01
  pour Top: 8.64,41.4 44.07,41.4 44.07,13.46 8.38,13.46 8.38,41.4
HDR1_1
  Bottom 0.813: SV1.1 42.55,11.43 43.94,10.03 45.34,10.03 JP2.37
HDR1_2
  Bottom 0.813: SV1.2 41.91,8.89 43.69,7.11 JP2.39
HDR1_3
  Bottom 0.813: SV1.3 41.78,6.35 43.56,4.57 JP2.41
HDR1_4
  Bottom 0.813: SV1.4 41.91,3.81 43.69,2.03 JP2.43
HDR2_1
  Bottom 0.61: SV2.1 9.4,52.32 7.24,50.16 5.21,50.16 JP1.6
HDR2_2
  Bottom 0.61: SV2.2 9.27,49.78 7.24,47.75 JP1.8
N$1
  Bottom 0.406: U1.1 14.62,7.13 21.08,7.11 21.08,5.71 21.08,2.41 R1.2 R2.1
  Bottom 1.016: X2.1 X2.2 21.21,5.84 21.08,5.71
N$2
  Bottom 0.305: 41.02,48.9 U2.6
  Bottom 0.61: 41.02,48.9 39.5,50.42 39.5,51.31 C11.1
N$3
  Bottom 0.61: C11.2 37.72,51.31 37.72,48.77 37.59,48.77 R10.1
N$4
  Bottom 0.406: U1.3 12.71,4.56 12.7,4.57 R2.2
N$6
  Bottom 0.406: R10.2 35.31,46.93 31.62,46.93 IC2.2
  Bottom 0.61: 35.31,46.93 34.61,47.63 R11.1 R12.1
N$7
  Bottom 0.61: R12.2 28.96,59.25 JP3.2
N$8
  Bottom 0.61: IC2.1 32.7,49.41 R11.2 32.7,51.5 29.21,54.99 27.62,54.99 R13.1 27.56,55.05 27.56,53.85 27.43,53.72 20.83,53.72 17.27,50.16 17.27,47.62 17.84,47.06 R8.1
  Bottom 1.016: R13.1 27.24,61.15 JP3.1
N$9
  Bottom 1.016: R14.2 19.11,56.58 U$1.SIG-
N$10
  Bottom 0.61: IC2.6 27.56,45.72 29.34,47.5 29.34,48.39 30.1,49.15 30.1,49.66 30.73,50.29 30.73,51.44 29.97,52.2 22.22,52.2 | 22.22,52.2 22.1,52.2 19.18,49.28 R8.2 | R9.1 22.1,52.07 22.22,52.2
N$11
  Bottom 0.61: IC2.7 22.16,46.99 R9.2 22.1,45.72 21.08,44.7 17.91,44.7 15.88,46.74 15.88,53.66 R14.1
N$12
  Bottom 1.016: R13.2 25.34,56.2 U$1.SIG+
V3V3  (via drill 0.8)
  Top 0.406: v7.62,4.57 7.62,9.65 | 7.62,9.65 7.62,15.11 | v29.97,37.08 29.84,36.96 C1.1 27.69,36.92 27.69,35.94 27.3,35.56 26.16,35.56 25.95,35.34 C2.1 | C3.1 29.21,31.5 v29.97,32.26 | C2.1 25.65,34.29 v23.37,32.26 | C4.1 24.77,28.83 v23.37,27.43 | C5.1 28.83,26.29 v29.97,27.43 | v29.97,17.78 29.21,18.54 C8.1 C7.1 C6.1 C5.1 | C5.1 27.65,27.34 27.43,27.56 26.29,27.56 26.04,27.81 26.04,28.74 C4.1 | C4.1 25.95,29.88 26.29,30.23 27.56,30.23 27.81,30.48 27.81,31.33 C3.1 | C3.1 27.65,32.68 27.56,32.77 26.16,32.77 25.91,33.02 25.91,34.25 C2.1 | C15.1 7.75,9.78 7.62,9.65
  Top 1.016: v7.62,52.83 7.62,15.11 8.51,12.95 27.69,12.95 27.65,15.96 C8.1
  Bottom 0.406: U1.5 8.89,6.48 v7.62,4.57 | JP1.2 v7.62,52.83 | IC1.25 30.02,17.83 v29.97,17.78 | IC1.7 30,32.23 v29.97,32.26 | IC1.44 23.6,32.23 v23.37,32.26 | IC1.1 30.02,37.03 v29.97,37.08 | IC1.13 v29.97,27.43 | v23.37,27.43 IC1.38
  Bottom 0.61: SV2.3 12.7,47.24 13.97,48.51 13.97,55.12 13.46,55.63 5.33,55.63 JP1.2
VCC  (via drill 0.8)
  Top 0.813: v42.93,45.21 42.93,47.62 42.93,52.58 JP2.1 | v29.08,50.67 29.08,48.77 29.08,47.37 30.67,45.78 33.4,42.93 v35.69,42.93
  Top 1.016: C12.1 42.25,48.3 42.93,47.62 | C13.1 28.96,48.64 29.08,48.77 | C14.1 30.61,45.72 30.67,45.78
  Bottom 0.406: U2.4 41.02,47.5 40.51,47.5 40.26,47.24 40.26,45.21 v42.93,45.21
  Bottom 0.61: JP2.1 44.64,56.45 R4.2 R7.2 | IC2.8 25.91,48.26 24.89,49.28 24.89,49.78 25.91,50.8 28.96,50.8 29.21,50.55 29.34,50.29 v29.08,50.67 | 43.05,45.09 v42.93,45.21
  Bottom 0.813: v35.69,42.93 43.05,42.93 43.05,45.09
VHALF  (via drill 0.8)
  Top 0.61: v35.81,58.29 35.81,46.86 v34.93,45.72
  Bottom 0.61: C10.1 C9.1 | C9.1 35.91,61.03 R6.2 | R6.2 R5.2 R4.1 | R7.1 R6.2 | v35.81,58.29 C9.1 | v34.93,45.72 IC2.3 29.84,45.72 28.57,44.45 IC2.5
  Bottom 1.016: C10.1 30.82,61.13 30.86,64.13 25.78,64.13 24.38,63.63 21.59,63.63 20.83,64.39 16.64,64.39 U$1.GND

### Text on the board
tPlace: Jan Marjanovic / 2014
bPlace: THEREMIN, proto1 / Jan Marjanovic, 2014